# EAGLE design BRAIN_Breakout_routed (EAGLE 6.5.0)
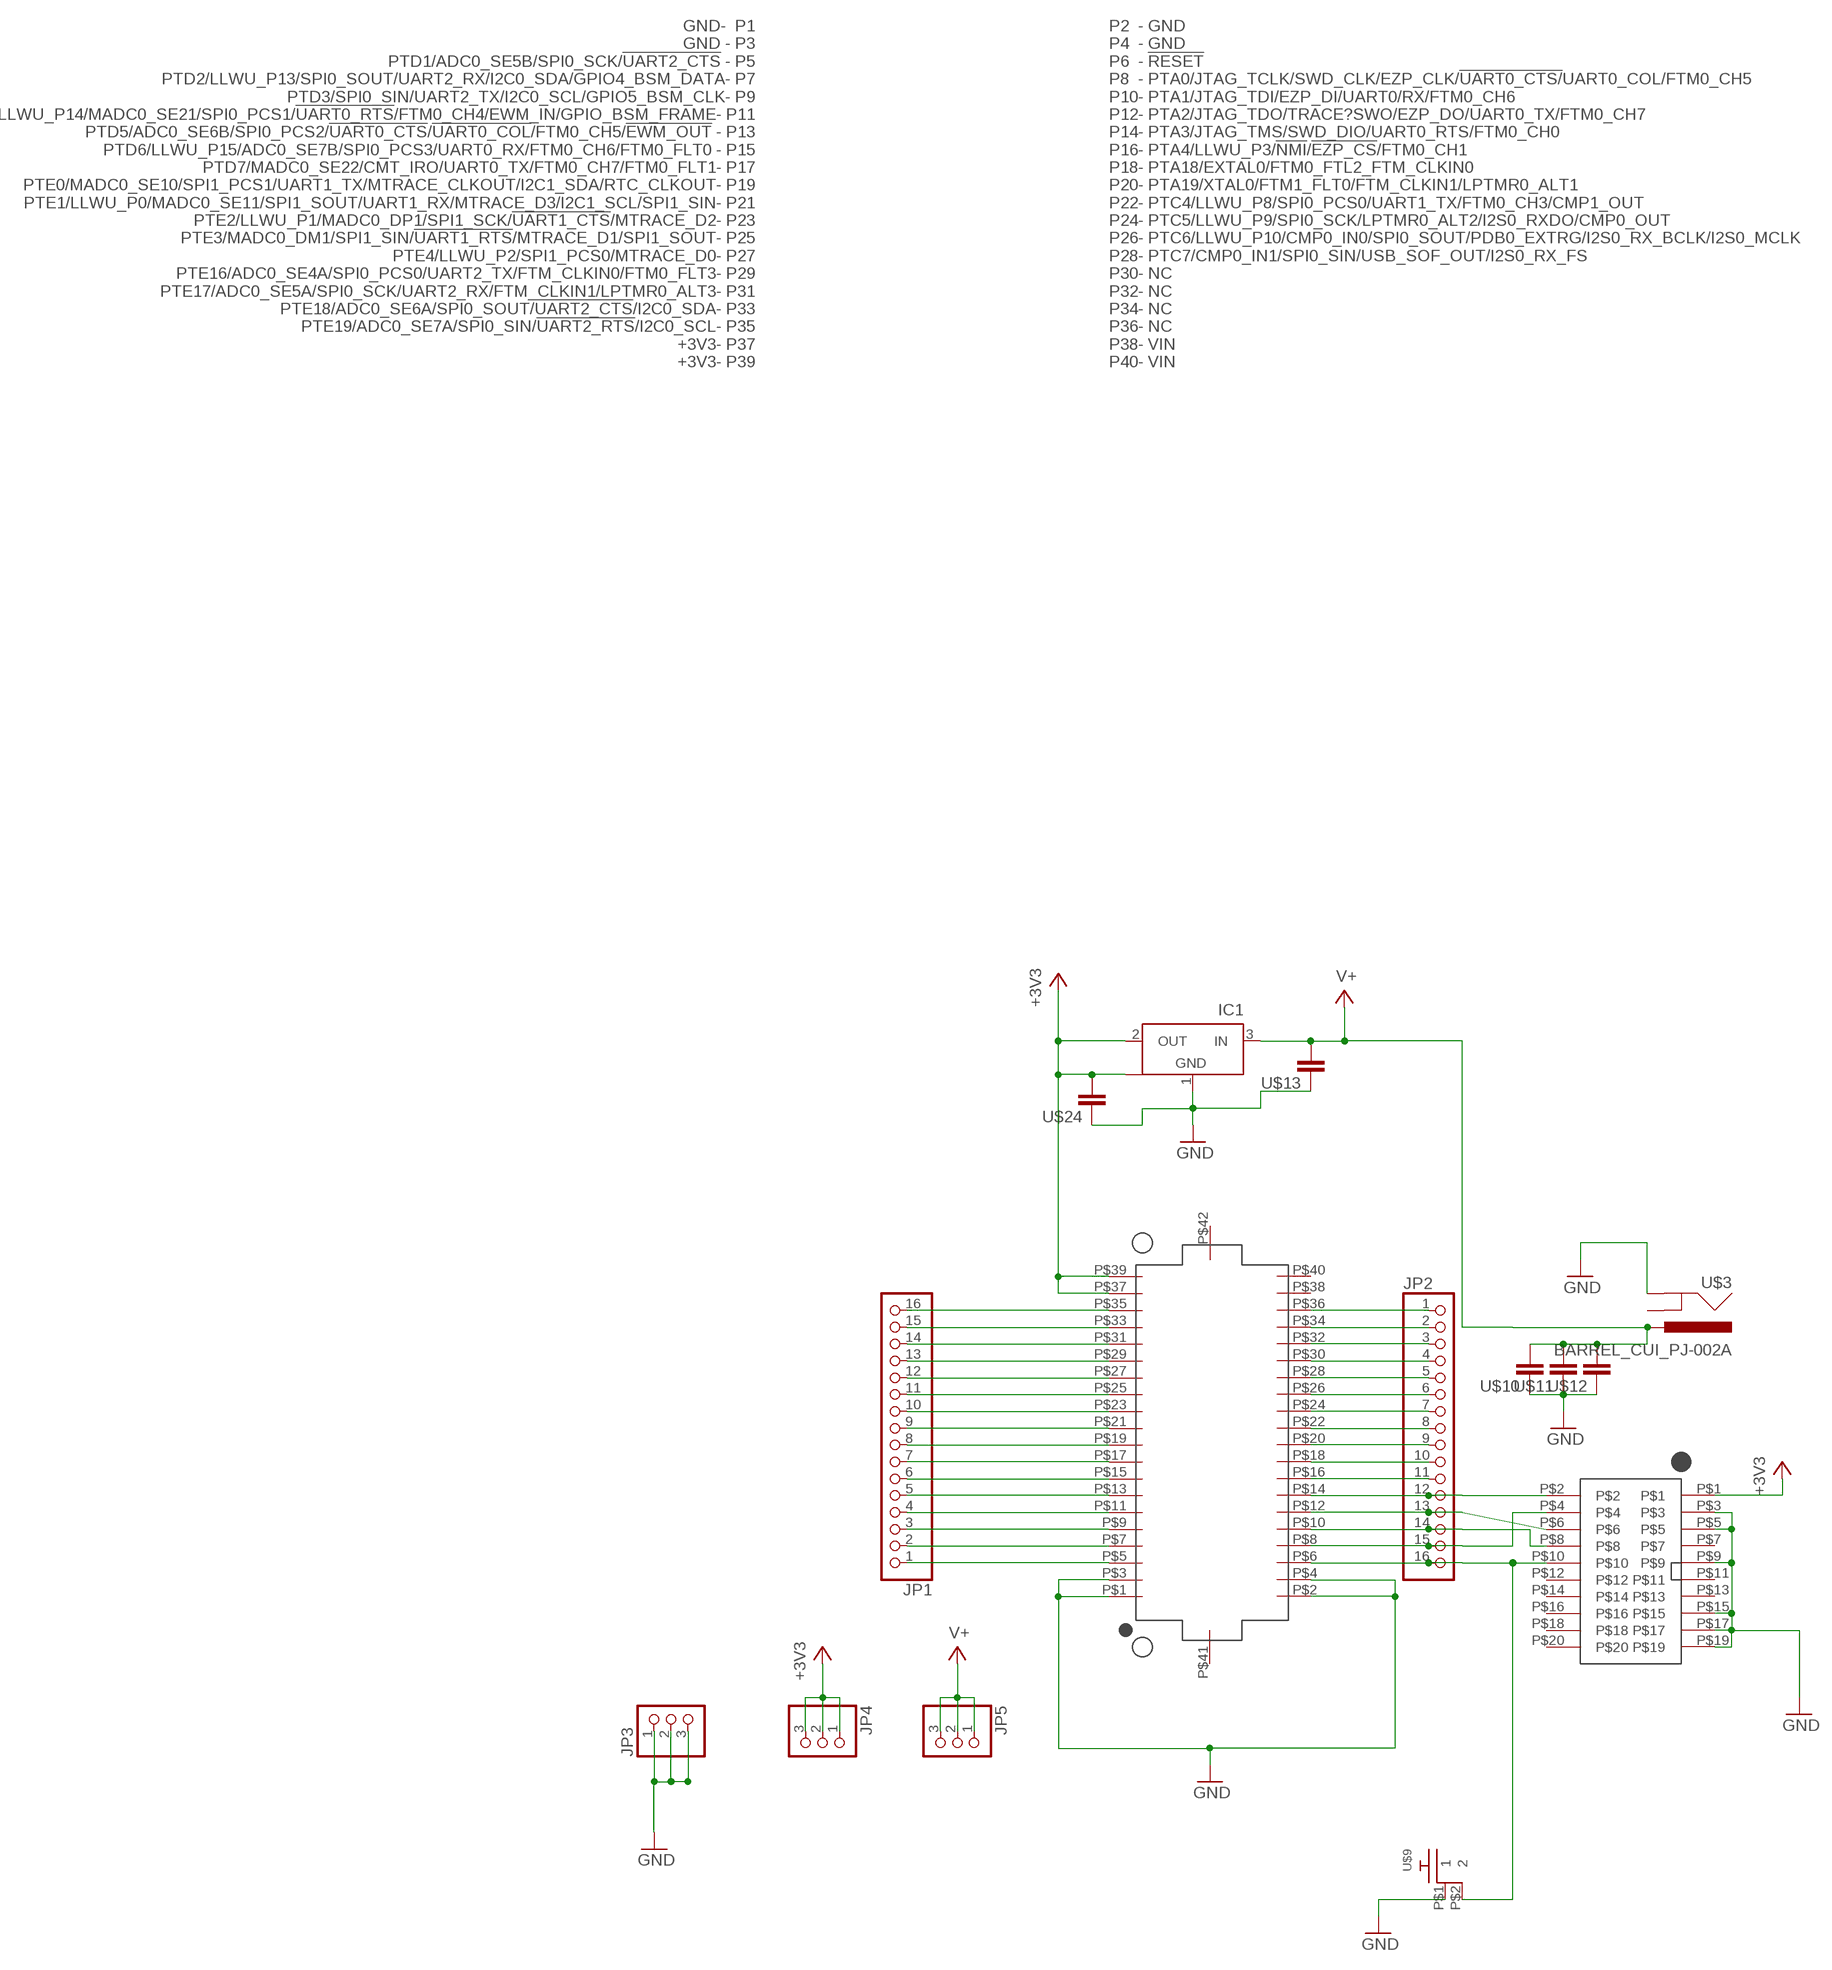
[diagram p0: schematic, sheet 1]

## Parts
IC1  NCP1117ST33T3G_1  [SOT223]
JP1  PINHD-1X16  [1X16]
JP2  PINHD-1X16  [1X16]
JP3  PINHD-1X3  [1X03]
JP4  PINHD-1X3  [1X03]
JP5  PINHD-1X3  [1X03]
U$1  DF12_F  [DF12_F]
U$3  BARREL_CUI_PJ-002A  [BARREL_CUI_PJ-002A]
U$9  RA_BUTTON  [RA_BUTTON]
U$10  RF-C0805  [C0805]
U$11  RF-C0805  [C0805]
U$12  RF-C0805  [C0805]
U$13  RF-C0805  [C0805]
U$19  2X10JTAG  [2X10JTAG]
U$24  RF-C0805  [C0805]

## Nets
+3V3: IC1.2(OUT) IC1.4(OUT1) JP4.1 JP4.2 JP4.3 U$1.P$37(+3V3) U$1.P$39(+3V3) U$19.P$1 U$24.2
GND: IC1.1(GND) JP3.1 JP3.2 JP3.3 U$1.P$1(GND) U$1.P$2(GND) U$1.P$3(GND) U$1.P$4(GND) U$3.P$2(GND) U$9.P$1 U$10.1 U$11.1 U$12.1 U$13.1 U$19.P$3 U$19.P$5 U$19.P$9 U$19.P$15 U$19.P$17 U$19.P$19 U$24.1
N$17: JP2.1 U$1.P$36(NC)
N$18: JP2.2 U$1.P$34(NC)
N$19: JP2.3 U$1.P$32(NC)
N$20: JP2.4 U$1.P$30(NC)
N$21: JP2.5 U$1.P$28(PTC7/CMP0_IN1/SPI0_SIN/USB_SOF_OUT/I2S0_RX_FS)
N$22: JP2.6 U$1.P$26(PTC6/LLWU_P10/CMP0_IN0/SPI0_SOUT/PDB0_EXTRG/I2S0_RX_BCLK/I2S0_MCLK)
N$23: JP2.7 U$1.P$24(PTC5/LLWU_P8/SPI0_PCS0/UART1_TX/FTM0_CH3/CMP1_OUT)
N$24: JP2.8 U$1.P$22(PTC4/LLWU_P8/SPI0_PCS0/UART1_TX/FTM0_CH3/CMP1_OUT)
N$25: JP2.9 U$1.P$20(PTA19/XTAL0/FTM1_FLT0/FTM_CLKIN1/LPTMR0_ALT1)
N$26: JP2.10 U$1.P$18(PTA18/EXTAL0/FTM0_FTL2_FTM_CLKIN0)
N$27: JP2.11 U$1.P$16(PTA4/LLWU_P3/!NMI!/!EZP_CS!/FTM0_CH1)
N$28: JP2.16 U$1.P$6(!RESET) U$9.P$2 U$19.P$10
N$33: JP2.15 U$1.P$8(PTA0/JTAG_TCLK/SWD_CLK/EZP_CLK/!UART0_CTS/!UART0_COL/FTM0_CH5) U$19.P$4
N$34: JP2.14 U$1.P$10(PTA1/JTAG_TDI/EZP_DI/UART0/RX/FTM0_CH6) U$19.P$8
N$35: JP2.12 U$1.P$14(PTA3/JTAG_TMS/SWD_DIO/UART0_RTS/FTM0_CH0) U$19.P$2
N$36: JP2.13 U$1.P$12(PTA2/JTAG_TDO/TRACE?SWO/EZP_DO/UART0_TX/FTM0_CH7) U$19.P$6
PTD1: JP1.1 U$1.P$5(PTD1/ADC0_SE5B/SPI0_SCK/!UART2_CTS)
PTD2: JP1.2 U$1.P$7(PTD2/LLWU_P13/SPI0_SOUT/UART2_RX/I2C0_SDA/GPIO4_BSM_DATA)
PTD3: JP1.3 U$1.P$9(PTD3/SPI0_SIN/UART2_TX/I2C0_SCL/GPIO5_BSM_CLK)
PTD4: JP1.4 U$1.P$11(PTD4/LLWU_P14/MADC0_SE21/SPI0_PCS1/!UART0_RTS!/FTM0_CH4/EWM_IN/GPIO_BSM_FRAME)
PTD5: JP1.5 U$1.P$13(PTD5/ADC0_SE6B/SPI0_PCS2/!UART0_CTS!/!UART0_COL!/FTM0_CH5/!EWM_OUT)
PTD6: JP1.6 U$1.P$15(PTD6/LLWU_P15/ADC0_SE7B/SPI0_PCS3/UART0_RX/FTM0_CH6/FTM0_FLT0)
PTD7: JP1.7 U$1.P$17(PTD7/MADC0_SE22/CMT_IRO/UART0_TX/FTM0_CH7/FTM0_FLT1)
PTE0: JP1.8 U$1.P$19(PTE0/MADC0_SE10/SPI1_PCS1/UART1_TX/MTRACE_CLKOUT/I2C1_SDA/RTC_CLKOUT)
PTE1: JP1.9 U$1.P$21(PTE1/LLWU_P0/MADC0_SE11/SPI1_SOUT/UART1_RX/MTRACE_D3/I2C1_SCL/SPI1_SIN)
PTE2: JP1.10 U$1.P$23(PTE2/LLWU_P1/MADC0_DP1/SPI1_SCK/!UART1_CTS!/MTRACE_D2)
PTE3: JP1.11 U$1.P$25(PTE3/MADC0_DM1/SPI1_SIN/!UART1_RTS!/MTRACE_D1/SPI1_SOUT)
PTE4: JP1.12 U$1.P$27(PTE4/LLWU_P2/SPI1_PCS0/MTRACE_D0)
PTE16: JP1.13 U$1.P$29(PTE16/ADC0_SE4A/SPI0_PCS0/UART2_TX/FTM_CLKIN0/FTM0_FLT3)
PTE17: JP1.14 U$1.P$31(PTE17/ADC0_SE5A/SPI0_SCK/UART2_RX/FTM_CLKIN1/LPTMR0_ALT3)
PTE18: JP1.15 U$1.P$33(PTE18/ADC0_SE6A/SPI0_SOUT/!UART2_CTS!/I2C0_SDA)
PTE19: JP1.16 U$1.P$35(PTE19/ADC0_SE7A/SPI0_SIN/!UART2_RTS!/I2C0_SCL)
V+: IC1.3(IN) JP5.1 JP5.2 JP5.3 U$3.P$1(PWR) U$10.2 U$11.2 U$12.2 U$13.2
Unconnected: U$1.P$38(VIN) U$1.P$40(VIN) U$1.P$41 U$1.P$42 U$3.P$3(GNDBREAK) U$19.P$7 U$19.P$11 U$19.P$12 U$19.P$13 U$19.P$14 U$19.P$16 U$19.P$18 U$19.P$20

## Library data of the parts
IC1 = KW2:NCP1117ST33T3G_1: VOLTAGE REGULATOR; MFGN: OnSemi; MFGP: NCP1117ST33T3G
JP1 JP2 = pinhead:PINHD-1X16: PIN HEADER
JP3-JP5 = pinhead:PINHD-1X3: PIN HEADER
U$1 = KW2:DF12_F; MFGN: Hirose; MFGP: DF12(3.0)-40DP-0.5V(86)
U$3 = KW2:BARREL_CUI_PJ-002A; MFGN: CUI; MFGP: PJ-002A
U$9 = KW2:RA_BUTTON
U$10-U$13 U$24 = GW-devices:RF-C: RF capacitor pads for FSL reference design
U$19 = KW2:2X10JTAG; MFGN: CNC Tech; MFGP: 3220-20-0100-00

## Board
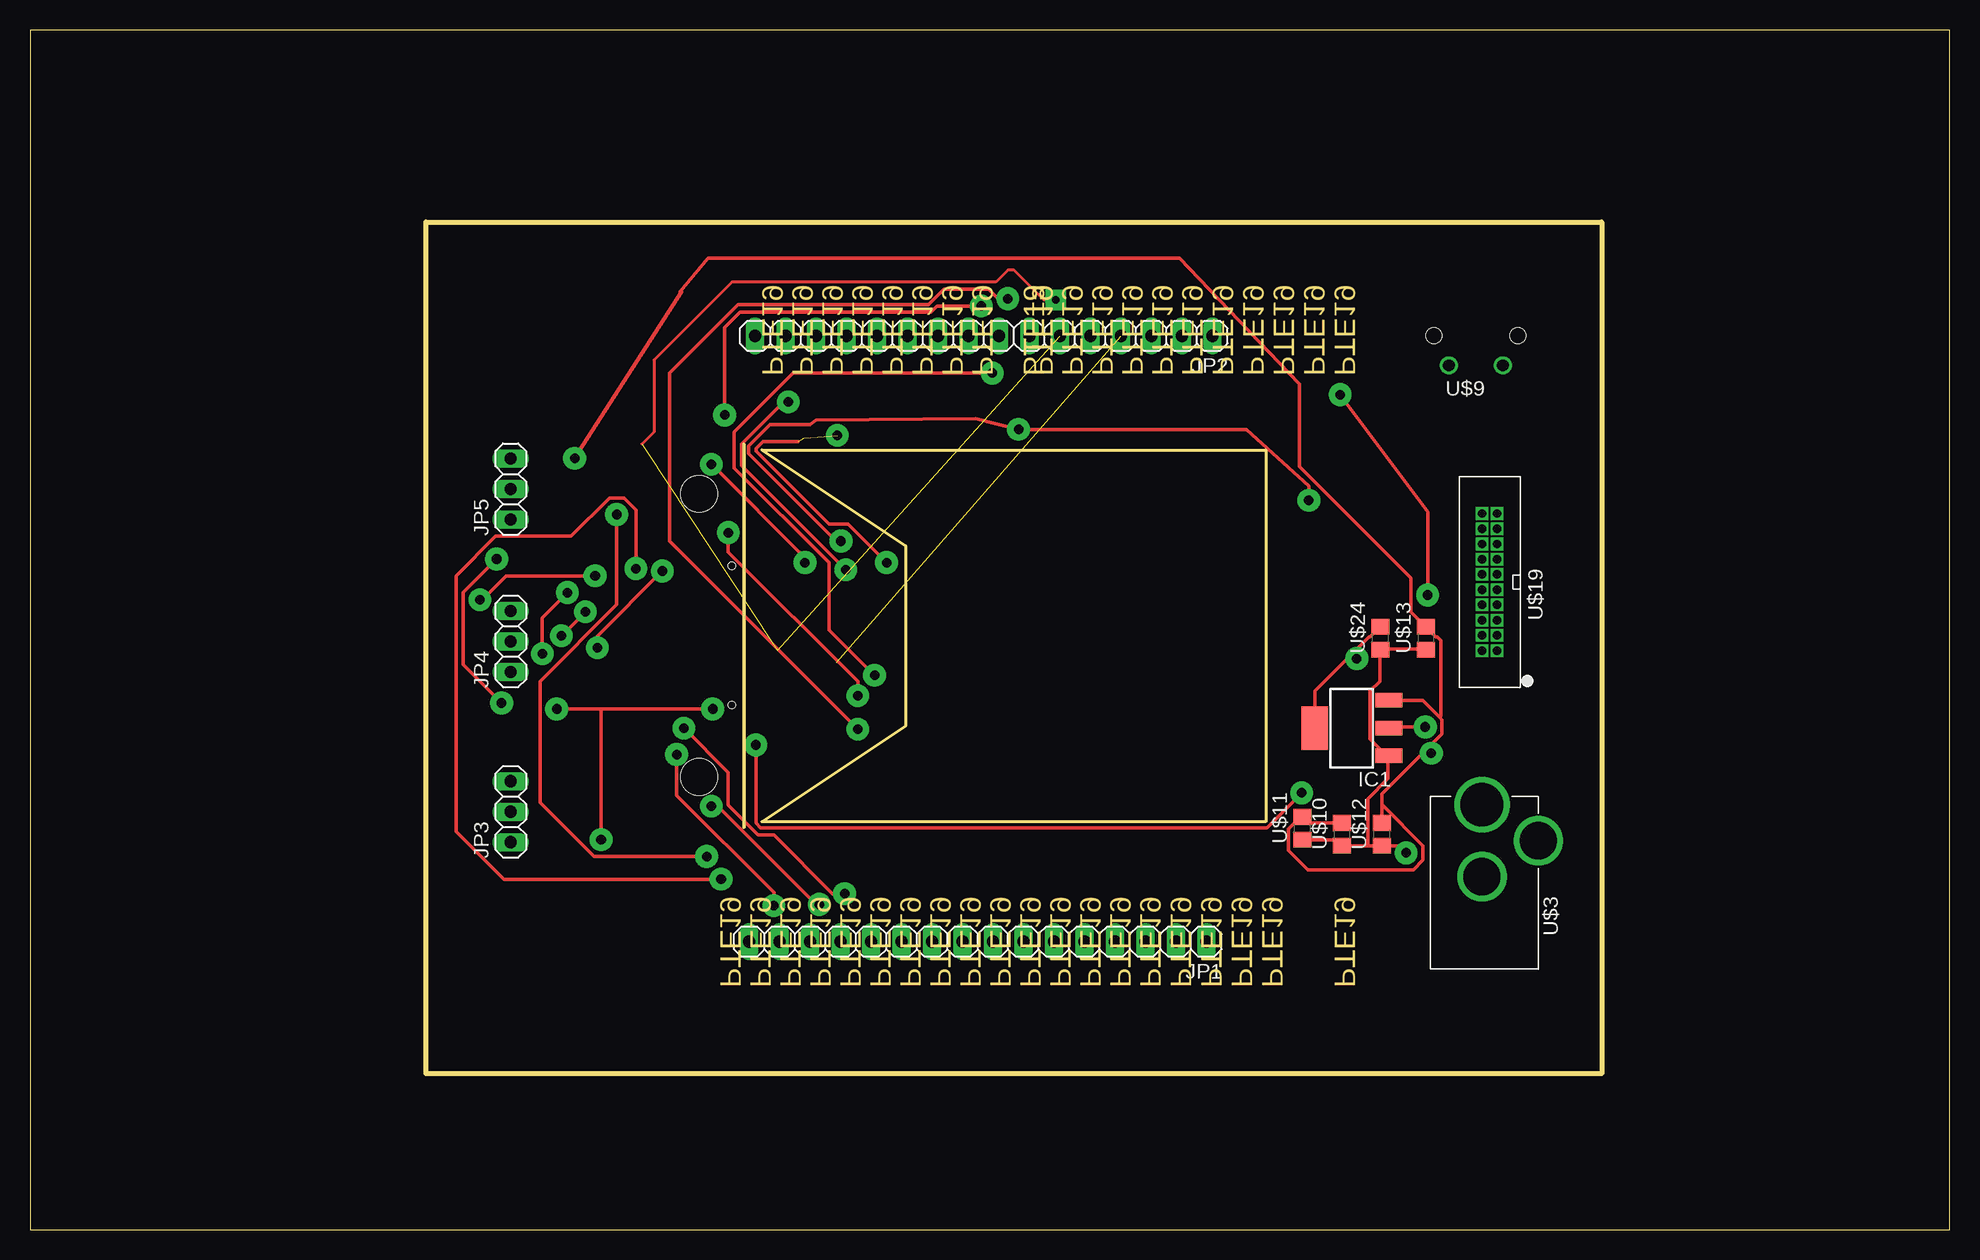
[diagram p1: board, top side]
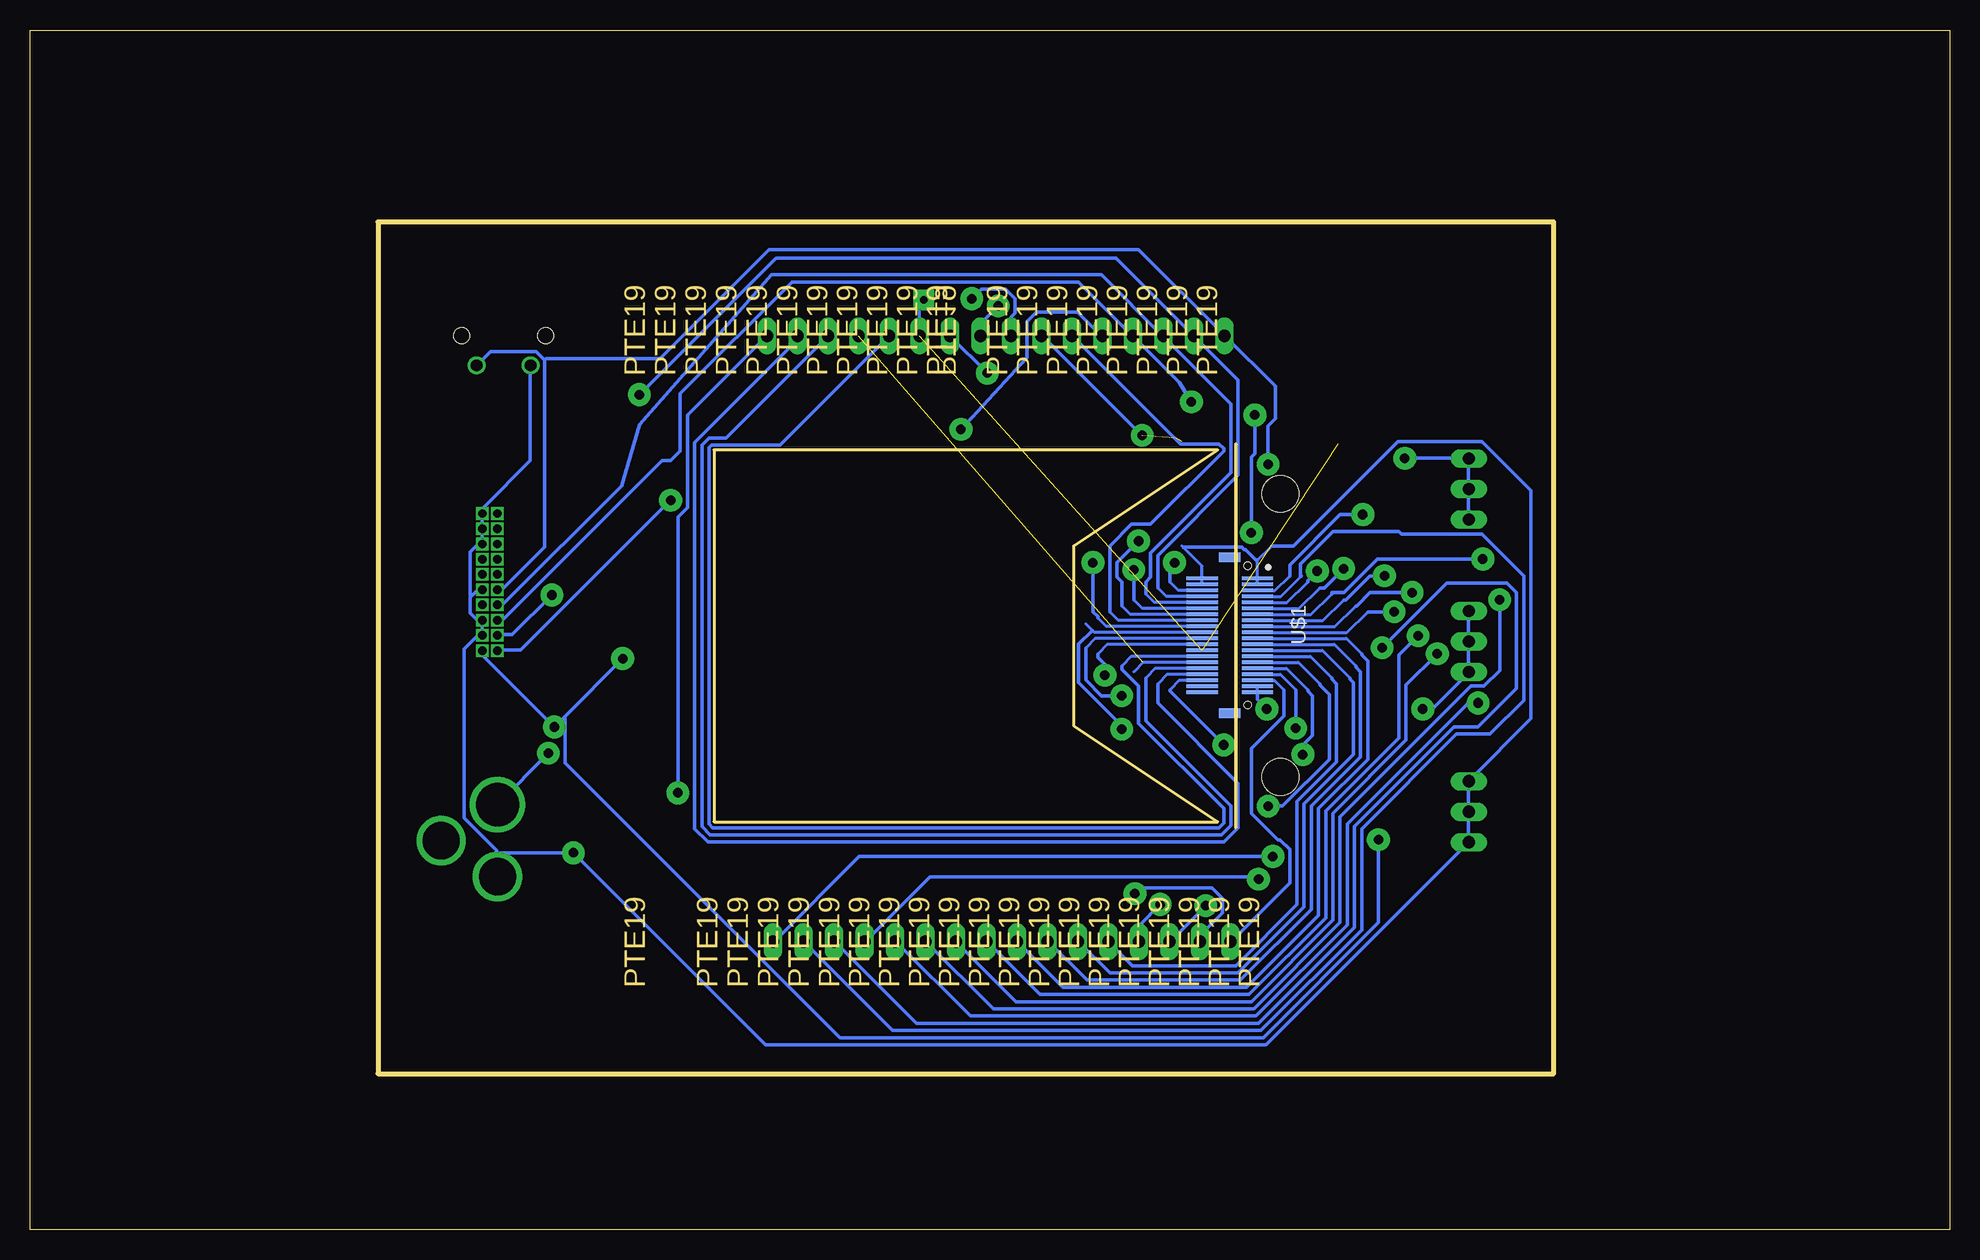
[diagram p2: board, bottom side, seen from below]

Size 160 x 100 mm. Coordinates in mm from the lower left corner, seen from the top.
Outline: 0,0 160,0 160,100 0,100 0,0
Outline: 33,84 131,84 131,13 33,13 33,84
Copper layers (1*16): Top 0.035mm / dielectric 1.5mm / Bottom 0.035mm
Design rules "default *": minimum track width 0.3mm, minimum drill 0.8mm, track to track 0.25mm, track to pad 0.25mm, pad to pad 0.25mm, via to via 0.25mm, smd to smd 0.25mm, copper to edge 0.1mm, drill to drill 0.1mm, minimum pad ring 0.1mm, minimum via ring 0.55mm, stop-mask expansion 4mil, vias tented up to drill 0mil, thermal gap 10mil
tRestrict: area 120,47 to 123.5,61; area 58,22 to 99.5,26; area 117,27 to 128,38; area 38.5,58 to 41.5,65.5; area 38.5,45 to 41.5,53; area 38,31 to 42,38.5
bRestrict: area 59,73 to 100,76

### Footprints (pad centres in the part's own frame; a part is rotated, then mirrored left to right if it is on the bottom)
SOT223 = smd 1.219 x 2.235: 1 -2.311,-3.099; 2 0,-3.099; 3 2.311,-3.099 | smd 3.6 x 2.2: 4 0,3.099
1X16 = drill 1.016 long: 1 -19.05,0; 2 -16.51,0; 3 -13.97,0; 4 -11.43,0; 5 -8.89,0; 6 -6.35,0; 7 -3.81,0; 8 -1.27,0; 9 1.27,0; 10 3.81,0; 11 6.35,0; 12 8.89,0; 13 11.43,0; 14 13.97,0; 15 16.51,0; 16 19.05,0
1X03 = drill 1.016 long: 1 -2.54,0; 2 0,0; 3 2.54,0
DF12_F = smd 0.3 x 2.6: P$1 -4.75,2.3; P$2 -4.75,-2.3; P$3 -4.25,2.3; P$4 -4.25,-2.3; P$5 -3.75,2.3; P$6 -3.75,-2.3; P$7 -3.25,2.3; P$8 -3.25,-2.3; P$9 -2.75,2.3; P$10 -2.75,-2.3; P$11 -2.25,2.3; P$12 -2.25,-2.3; P$13 -1.75,2.3; P$14 -1.75,-2.3; P$15 -1.25,2.3; P$16 -1.25,-2.3; P$17 -0.75,2.3; P$18 -0.75,-2.3; P$19 -0.25,2.3; P$20 -0.25,-2.3; P$21 0.25,2.3; P$22 0.25,-2.3; P$23 0.75,2.3; P$24 0.75,-2.3; P$25 1.25,2.3; P$26 1.25,-2.3; P$27 1.75,2.3; P$28 1.75,-2.3; P$29 2.25,2.3; P$30 2.25,-2.3; P$31 2.75,2.3; P$32 2.75,-2.3; P$33 3.25,2.3; P$34 3.25,-2.3; P$35 3.75,2.3; P$36 3.75,-2.3; P$37 4.25,2.3; P$38 4.25,-2.3; P$39 4.75,2.3; P$40 4.75,-2.3 | smd 0.8 x 1.8: P$41 -6.5,0; P$42 6.5,0 | hole 0.6: -5.8,1.5; 5.8,1.5 | hole 3.048: -11.8,4.24; 11.8,4.24
BARREL_CUI_PJ-002A = drill 3.6: P$1 0,0 | drill 3.1: P$2 6,0; P$3 3,4.7
RA_BUTTON = drill 0.99: P$1 -2.25,0; P$2 2.25,0 | hole 1.3: -3.501,2.49; 3.501,2.49
C0805 = smd 1.3 x 1.5: 1 -0.95,0; 2 0.95,0
2X10JTAG = drill 0.7 pad 1 square: P$1 -6.35,-1.27; P$2 -6.35,0; P$3 -5.08,-1.27; P$4 -5.08,0; P$5 -3.81,-1.27; P$6 -3.81,0; P$7 -2.54,-1.27; P$8 -2.54,0; P$9 -1.27,-1.27; P$10 -1.27,0; P$11 0,-1.27; P$12 0,0; P$13 1.27,-1.27; P$14 1.27,0; P$15 2.54,-1.27; P$16 2.54,0; P$17 3.81,-1.27; P$18 3.81,0; P$19 5.08,-1.27; P$20 5.08,0

### Placement (x,y rotation side)
IC1  110.17,41.8 90 top
JP1  79,24 180 top
JP2  79.5,74.5 180 top
JP3  40.07,34.83 90 top
JP4  40.07,49.03 90 top
JP5  40.07,61.73 90 top
U$1  60,49.53 270 bottom
U$3  121.03,35.41 270 top
U$9  120.53,72.04 0 top
U$10  109.37,32.95 90 top
U$11  106.06,33.45 90 top
U$12  112.68,32.95 90 top
U$13  116.37,49.3 90 top
U$19  121.03,54.61 90 top
U$24  112.56,49.3 90 top

### Tracks (layer width: path | path; a pad name or v marks a point on that pad's centre or on a via)
+3V3  (via drill 0.8)
  Top 0.3: v43.9,43.4 47.6,43.4 | 47.6,43.4 v56.9,43.4 | 110.2,48 107.1,44.9 107.1,41.8 IC1.4 | 110.2,48 111.6,49.4 111.7,49.4 112.5,50.2 U$24.2 | v116.3,41.9 113.4,41.9 113.3,41.8 IC1.2 | v110.6,47.6 110.2,48 | v47.6,32.5 47.6,43.4
  Bottom 0.254: U$1.P$39 U$1.P$37
  Bottom 0.3: U$1.P$39 57.7,44.2 v56.9,43.4 | v43.9,43.4 43.1,43.4 40.1,46.4 JP4.1 40.1,46.6 40.1,49 JP4.2 40.1,49.1 40.1,51.5 JP4.3 | U$19.P$1 122.3,47.9 v116.3,41.9 115.5,42.7 | 115.5,42.7 v110.6,47.6 | v47.6,32.5 47.6,25.6 57.2,16 92.5,16 115.4,38.9 115.4,42.6 115.5,42.7
GND  (via drill 0.8)
  Top 0.3: U$13.1 116.3,48.4 112.6,48.4 U$24.1 112.5,48.3 112.5,45.7 111.7,44.9 111.7,40.9 113.1,39.5 IC1.1 | 113.3,39.5 IC1.1 | 111.5,32 U$12.1 114.1,32 v114.7,31.4 | 111.5,32 U$10.1 109.3,32.1 108.9,32.5 U$11.1 | 111.5,32 111.5,35.9 113.2,37.6 113.2,39.4 IC1.1
  Bottom 0.254: 64,57 63.85,56.85 62.3,55.3 U$1.P$2 U$1.P$4 | 56.5,57 57.7,55.8 U$1.P$1 U$1.P$3
  Bottom 0.3: 57.7,55.8 57.8,55.8 58.7,56.7 58.8,56.7 59,56.9 63.8,56.9 63.85,56.85 | 56.5,57 54.7,57 46,65.7 39,65.7 34.9,61.6 34.9,42.6 40,37.5 JP3.3 40.1,37.3 40.1,34.9 JP3.2 40.1,34.8 40.1,32.3 JP3.1 40.2,32.2 57,15.4 98.7,15.4 v114.7,31.4 121,31.4 U$3.P$2 121.1,29.5 121.1,31.6 123.8,34.3 123.8,48.4 122.4,49.8 U$19.P$3 U$19.P$5 122.4,50.5 123.3,51.4 123.3,52.7 123.2,52.8 | 123.2,52.8 122.7,53.3 122.3,53.3 U$19.P$9 | 123.2,52.8 123.3,52.9 123.3,56.5 122.7,57.1 122.4,57.1 U$19.P$15 U$19.P$17 U$19.P$19 122.2,59.8 122.2,60.2 118.3,64.1 118.3,72 U$9.P$1
N$17  (via drill 0.8)
  Top 0.3: v60.5,40.4 60.5,33.9 60.9,33.5 103.1,33.5 v106,36.4
  Bottom 0.254: U$1.P$36 64.22,45.78 65,45
  Bottom 0.3: v60.5,40.4 65,44.9 65,45 | v106,36.4 106,59.4 105.2,60.2 105.2,67.9 98.6,74.5 JP2.1
N$18
  Bottom 0.254: U$1.P$34 65.22,46.28 66,45.5
  Bottom 0.3: 66,45.5 66,43.9 59.3,37.2 59.3,33.5 60.5,32.3 103.5,32.3 104.6,33.4 104.6,65.6 96.1,74.1 96.1,74.5 JP2.2
N$19
  Bottom 0.254: U$1.P$32 66.22,46.78 67,46
  Bottom 0.3: 67,46 67,42.4 59.9,35.3 59.9,33.7 60.7,32.9 103.3,32.9 104,33.6 104,65.4 103.4,66 102,66 93.5,74.5 JP2.3
N$20  (1 unrouted)
  Bottom 0.254: U$1.P$30 67.22,47.28 68,46.5
N$21
  Bottom 0.254: U$1.P$28 68.22,47.78 69,47
  Bottom 0.3: 69,47 69,46.7 67.6,45.3 67.6,42.2 60.5,35.1 60.5,33.9 60.9,33.5 103.1,33.5 103.4,33.8 103.4,65.2 103.2,65.4 97.5,65.4 JP2.5
N$22  (via drill 0.6)  (2 unrouted)
  Top 0.254: v85.5,77.5 84.5,77.5 82,80 81.5,80 80.5,79 58.5,79 52,72.5 52,66.5 51,65.5
  Bottom 0.254: JP2.6 85.85,77.15 v85.5,77.5
N$23  (via drill 0.8)
  Top 0.3: v80.2,71.4 63.6,71.4 58.7,66.5 58.7,63.5 66.6,55.6 66.6,50 v70.4,46.2
  Bottom 0.254: U$1.P$24 70.22,48.78 71,48
  Bottom 0.3: v80.2,71.4 JP2.7 | v70.4,46.2 70.4,47.1 71,47.7 71,48
N$24  (via drill 0.8)
  Top 0.3: v79.3,77 75.6,77 75.1,76.5 59.2,76.5 57.9,75.2 v57.9,67.9 | v58.2,58.1 58.2,56.5 69,45.7 v69,44.5
  Bottom 0.254: U$1.P$22 71.22,49.28 72,48.5
  Bottom 0.3: v79.3,77 80.7,75.6 80.7,74.5 JP2.8 | v57.9,67.9 57.9,64.7 58.2,64.4 v58.2,58.1 | v69,44.5 70.7,44.5 72,45.8 72,48.5
N$25  (via drill 0.8)
  Top 0.3: v81.5,77.6 80.7,77.6 79.9,78.4 76.2,78.4 74.9,77.1 59,77.1 53.3,71.4 53.3,57.4 v69,41.7
  Bottom 0.254: U$1.P$20 71.28,49.78 71.45,49.95 72,50.5
  Bottom 0.3: v81.5,77.6 80.7,78.4 78.7,78.4 77.9,77.6 77.9,76.4 78.2,76.1 78.2,74.5 JP2.9 | v69,41.7 69,42 72.6,45.6 72.6,48.8 71.45,49.95
N$26  (via drill 0.8)  (2 unrouted)
  Top 0.3: 64,65.7 61.1,65.7 60.5,65.1 60.5,64.9 66.6,58.8 68.2,58.8 v71.4,55.6
  Bottom 0.254: U$1.P$18 70.28,50.28 71,51
  Bottom 0.3: v67.3,66.2 75.6,74.5 JP2.10 | v71.4,55.6 71.4,51.5 71,51.1 71,51
N$27
  Bottom 0.254: U$1.P$16 69.28,50.78 70,51.5
  Bottom 0.3: 70,51.5 70,57 68.2,58.8 66.6,58.8 60.5,64.9 60.5,65.1 60.9,65.5 64.1,65.5 73.1,74.5 JP2.11
N$28  (via drill 0.8)
  Top 0.3: v64.6,55.6 64.6,56 v56.8,63.8
  Bottom 0.254: U$1.P$6 64.28,53.28 65,54
  Bottom 0.3: 117.1,72.5 117.1,56.9 120.6,53.4 121,53.4 U$19.P$10 | 117.1,72.5 117.8,73.2 121.6,73.2 122.7,72.1 U$9.P$2 | 65,54 65,55.2 v64.6,55.6 | v56.8,63.8 56.8,67 56.2,67.6 56.2,70.3 60.4,74.5 JP2.16 60.5,74.6 67.6,81.7 98.4,81.7 107.5,72.6 117,72.6 117.1,72.5
N$33  (via drill 0.8)
  Top 0.3: v116.5,52.9 116.5,59.8 v109.2,69.6
  Bottom 0.254: U$1.P$8 65.28,52.78 66,53.5
  Bottom 0.3: v116.5,52.9 119.8,49.6 121,49.6 U$19.P$4 | v109.2,69.6 97.8,81 69.5,81 JP2.15 62.9,74.4 59.3,70.8 59.3,62.9 66,56.2 66,53.5
N$34
  Bottom 0.254: U$1.P$10 66.28,52.28 67,53
  Bottom 0.3: U$19.P$8 121,52.1 120.6,52.1 110.7,62 109.2,67.1 98.2,79.6 70.7,79.6 65.6,74.5 JP2.14 65.5,74.4 59.9,68.8 59.9,63.1 66.6,56.4 66.6,54.4 67,54 67,53
N$35  (via drill 0.8)
  Top 0.3: v106.6,60.8 106.6,62 101.4,66.7 v82.4,66.7 78.8,67.6 65.5,67.5 65,67.1 61.7,67.1 59.9,65.3 59.9,64.7 67.2,57.4 v67.6,57.4
  Bottom 0.254: U$1.P$14 68.28,51.28 69,52
  Bottom 0.3: v106.6,60.8 119.1,48.3 121,48.3 U$19.P$2 | v82.4,66.7 76.9,72.7 76.9,75.7 76.1,76.5 72.7,76.5 70.7,74.5 JP2.12 | 69,52 69,54 69.4,54.4 69.4,55.6 v67.6,57.4
N$36  (via drill 0.8)
  Top 0.3: v68,55 59.3,63.7 59.3,65.5 62.8,69 v63.2,69
  Bottom 0.254: U$1.P$12 67.28,51.78 68,52.5
  Bottom 0.3: U$19.P$6 120.6,50.8 107.3,64.1 106.6,64.1 105.8,64.9 105.8,69.7 96.5,79 72.6,79 68.1,74.5 JP2.13 68,74.4 64.2,70.6 v63.2,69 | v68,55 68,52.5
PTD1  (via drill 0.8)
  Top 0.3: v48.9,59.6 48.9,52.1 42.5,45.7 42.5,35.6 47,31.1 v56.4,31.1
  Bottom 0.254: U$1.P$5 56.22,53.28 55,54.5
  Bottom 0.3: 55,54.5 55,55.4 50.8,59.6 v48.9,59.6 | v56.4,31.1 90.9,31.1 98,24 JP1.1
PTD2
  Bottom 0.254: U$1.P$7 55.72,52.78 54.05,54.45 54,54.5
  Bottom 0.3: JP1.2 88.1,16.6 57.4,16.6 49,25 49,33.4 41.1,41.3 38.3,41.3 35.5,44.1 35.5,54.5 39,58 45.7,58 45.9,58.2 51.4,58.2 54.1,55.5 54.1,54.5 54.05,54.45
PTD3  (via drill 0.8)
  Top 0.3: v47.3,48.5 47.3,49.5 v52.7,54.9
  Bottom 0.254: U$1.P$9 55.22,52.28 53.5,54
  Bottom 0.3: v47.3,48.5 41.9,53.9 36.9,53.9 36.1,53.1 36.1,45.1 39.3,41.9 41.3,41.9 49.6,33.6 49.6,25.2 57.6,17.2 86.1,17.2 92.9,24 JP1.3 | v52.7,54.9 53.5,54.1 53.5,54
PTD4  (via drill 0.8)
  Top 0.3: v57.6,29.2 39.5,29.2 35.5,33.2 35.5,54.5 38.8,57.8 45.1,57.8 48.3,61 49.5,61 50.5,60 v50.5,55.1
  Bottom 0.254: U$1.P$11 54.22,51.78 52.5,53.5
  Bottom 0.3: v57.6,29.2 57.8,29.4 85,29.4 90.4,24 JP1.4 | v50.5,55.1 52.1,53.5 52.5,53.5
PTD5  (via drill 0.8)
  Top 0.3: v39.3,43.9 36.1,47.1 36.1,53.1 v38.9,55.9
  Bottom 0.254: U$1.P$13 53.22,51.28 51.5,53
  Bottom 0.3: v39.3,43.9 40.1,43.9 50.2,33.8 50.2,25.4 57.8,17.8 81.6,17.8 87.8,24 JP1.5 | v38.9,55.9 47.7,55.9 50.5,53.1 51.5,53.1 51.5,53
PTD6  (via drill 0.8)
  Top 0.3: v37.5,52.5 37.7,52.5 39.7,54.5 v47.1,54.5
  Bottom 0.254: U$1.P$15 52.22,50.78 50.5,52.5
  Bottom 0.3: v37.5,52.5 37.5,46.6 38.8,45.3 39.9,45.3 50.8,34.4 50.8,25.6 58,18.4 79.7,18.4 85.3,24 JP1.6 | v47.1,54.5 48.3,54.5 50.3,52.5 50.5,52.5
PTD7  (via drill 0.8)
  Top 0.3: v42.7,48 42.7,51 v44.8,53.1
  Bottom 0.254: U$1.P$17 51.22,50.28 49.5,52
  Bottom 0.3: v42.7,48 45.3,45.4 45.3,40.8 51.4,34.7 51.4,25.8 58.2,19 77.8,19 JP1.7 | v44.8,53.1 48.3,53.1 49.4,52 49.5,52
PTE0  (via drill 0.8)
  Top 0.3: v46.3,51.5 v44.3,49.5
  Bottom 0.254: U$1.P$19 50.22,49.78 48.5,51.5
  Bottom 0.3: v44.3,49.5 45.9,47.9 45.9,41 52,34.9 52,26 58.4,19.6 75.8,19.6 80.2,24 JP1.8 | 48.5,51.5 v46.3,51.5
PTE1
  Bottom 0.254: U$1.P$21 50.28,49.28 49,48
  Bottom 0.3: JP1.9 77.7,24 73.9,20.2 58.6,20.2 52.6,26.2 52.6,35.1 48.5,39.2 48.5,47.4 49,47.9 49,48
PTE2
  Bottom 0.254: U$1.P$23 51.28,48.78 49.5,47
  Bottom 0.3: JP1.10 75.1,24 71.9,20.8 59.1,20.8 53.2,26.7 53.2,35.3 49.1,39.4 49.1,46.5 49.5,46.9 49.5,47
PTE3
  Bottom 0.254: U$1.P$25 52.28,48.28 50,46
  Bottom 0.3: JP1.11 72.6,24 70,21.4 59.3,21.4 53.8,26.9 53.8,35.5 49.7,39.6 49.7,45.6 50,45.9 50,46
PTE4
  Bottom 0.254: U$1.P$27 53.28,47.78 51.5,46
  Bottom 0.3: JP1.12 68.1,22 59.5,22 54.4,27.1 54.4,35.7 51.1,39 51.1,45.5 51.5,45.9 51.5,46
PTE16  (via drill 0.8)
  Top 0.3: v65.8,27.1 65.5,27.1 57.3,35.3 v56.8,35.3
  Bottom 0.254: U$1.P$29 54.28,47.28 52.5,45.5
  Bottom 0.3: v65.8,27.1 67.5,25.4 67.5,24 JP1.13 | v56.8,35.3 55.6,35.3 51.7,39.2 51.7,44.6 52.5,45.4 52.5,45.5
PTE17  (via drill 0.8)
  Top 0.3: v62,27 62,28.1 53.9,36.2 v53.9,39.6
  Bottom 0.254: U$1.P$31 55.28,46.78 53.5,45
  Bottom 0.3: v62,27 65,24 JP1.14 | v53.9,39.6 53.9,40.4 53.1,41.2 53.1,44.5 53.5,44.9 53.5,45
PTE18  (via drill 0.8)
  Top 0.3: v67.9,28 66.9,28 62,32.9 60.7,32.9 58.2,35.4 58.2,38.1 v54.5,41.8
  Bottom 0.254: U$1.P$33 55.78,46.28 54.5,45
  Bottom 0.3: v67.9,28 67.4,28.5 61.5,28.5 60.6,27.6 60.6,26.4 62.4,24.6 62.4,24 JP1.15 | 54.5,45 v54.5,41.8
PTE19
  Bottom 0.254: U$1.P$35 56.28,45.78 55.5,45
  Bottom 0.3: 55.5,45 55.5,42.8 58.2,40.1 58.2,34.7 56,32.5 55.8,32.5 55,31.7 55,28.9 59.9,24 JP1.16
V+  (via drill 0.8)
  Top 0.3: U$10.2 106.6,33.9 106.1,34.4 U$11.2 106,34.3 105.8,34.3 104.9,33.4 104.9,31.6 106.5,30 115.3,30 116.1,30.8 116.1,32 112.8,35.3 112.7,35.3 | 112.7,35.3 112.7,36.3 116.45,40.05 | 112.7,35.3 112.7,33.9 U$12.2 | 116.45,40.05 117.7,41.3 117.7,42.5 117.5,42.7 | 117.5,42.7 116.1,44.1 113.3,44.1 IC1.3 | 117.5,42.7 117.6,42.8 117.6,49.1 117.3,49.4 117.2,49.4 116.4,50.2 U$13.2 116.3,50.3 115.1,51.5 115.1,54.3 105.8,63.6 105.8,70.5 95.8,81 56.5,81 54.2,78.2 54.3,78.2 v45.4,64.3 | 116.45,40.05 v116.8,39.7
  Bottom 0.3: JP5.1 40.1,59.2 40.1,61.7 JP5.2 40.1,61.8 40.1,64.2 JP5.3 40.2,64.3 v45.4,64.3 | v116.8,39.7 121,35.5 U$3.P$1

### Text on the board
Milling: PTE19 | PTE19 | PTE19 | PTE19 | PTE19 | PTE19 | PTE19 | PTE19 | PTE19 | PTE19 | PTE19 | PTE19 | PTE19 | PTE19 | PTE19 | PTE19 | PTE19 | PTE19 | PTE19 | PTE19 | PTE19 | PTE19 | PTE19 | PTE19 | PTE19 | PTE19 | PTE19 | PTE19 | PTE19 | PTE19 | PTE19 | PTE19 | PTE19 | PTE19 | PTE19 | PTE19 | PTE19 | PTE19 | PTE19 | PTE19